# Altium project tinySniff.PrjPcb
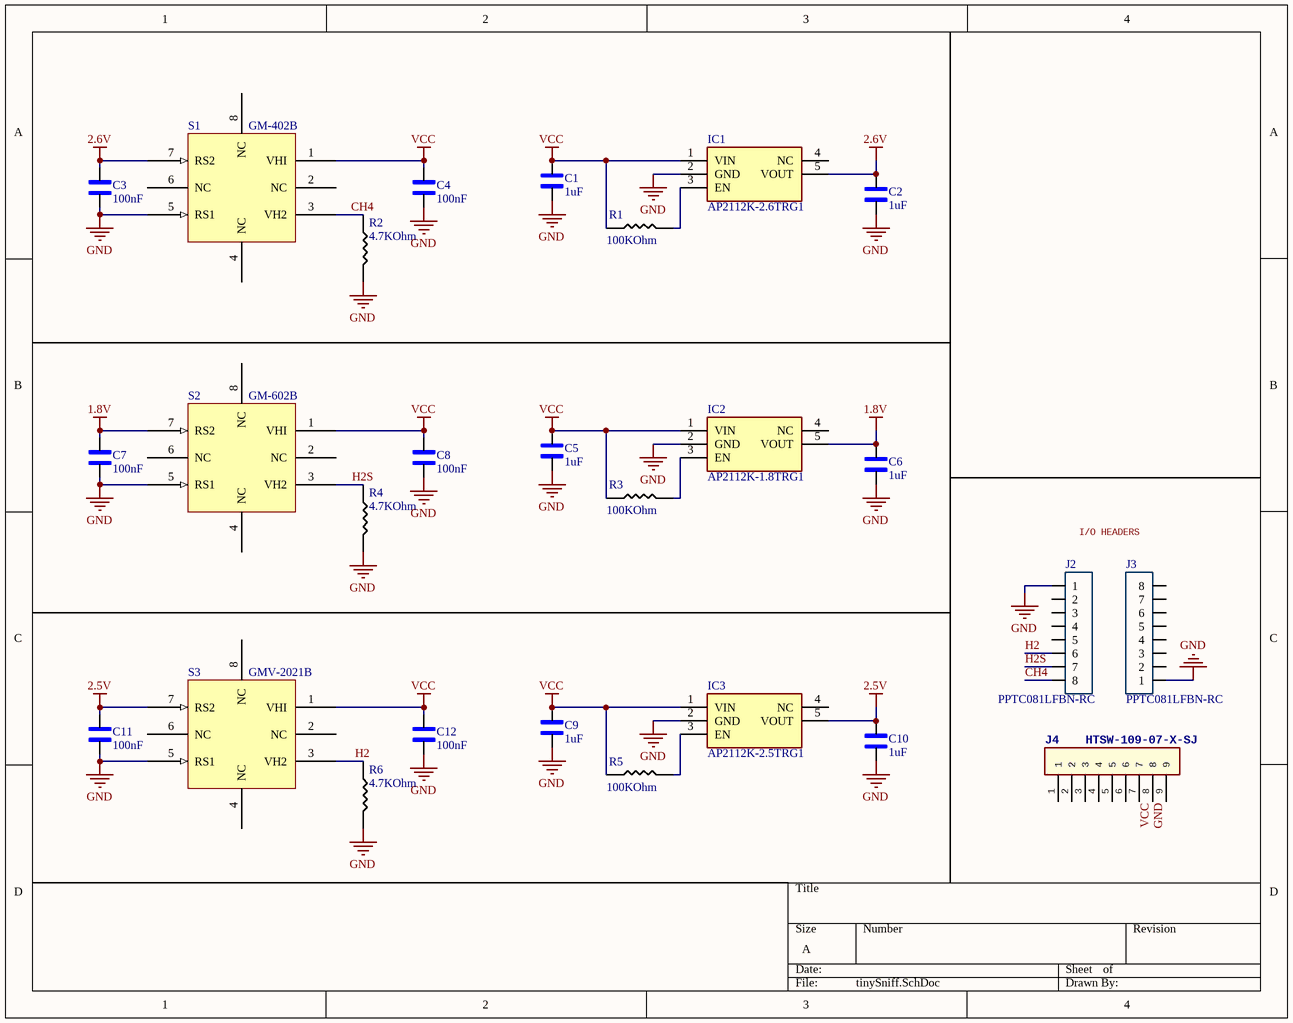
[diagram p0: tinySniff.SchDoc]
1 sheet, 27 parts. Net scope: global (net labels, ports and power ports of the same name join across sheets).
Board file: tinySniff.PcbDoc

## Sheet tinySniff.SchDoc
size A; SheetNumber: 1; SheetTotal: 1

### Parts
C1  1uF  [1206_Passive_Capacitor]
C2  1uF  [1206_Passive_Capacitor]
C3  100nF  [1206_Passive_Capacitor]
C4  100nF  [1206_Passive_Capacitor]
C5  1uF  [1206_Passive_Capacitor]
C6  1uF  [1206_Passive_Capacitor]
C7  100nF  [1206_Passive_Capacitor]
C8  100nF  [1206_Passive_Capacitor]
C9  1uF  [1206_Passive_Capacitor]
C10  1uF  [1206_Passive_Capacitor]
C11  100nF  [1206_Passive_Capacitor]
C12  100nF  [1206_Passive_Capacitor]
IC1  AP2112K-2.6TRG1  [SOT95P285X140-5N]
IC2  AP2112K-1.8TRG1  [SOT95P285X140-5N]
IC3  AP2112K-2.5TRG1  [SOT95P285X140-5N]
J2  PPTC081LFBN-RC  [8_PIN_100MIL - Female]
J3  PPTC081LFBN-RC  [8_PIN_100MIL - Female]
J4  HTSW-109-07-X-SJ  [JM-9_HTSW-109-07-X-S]
R1  100KOhm  [1206_Passive_Resitor]
R2  4.7KOhm  [1206_Passive_Resitor]
R3  100KOhm  [1206_Passive_Resitor]
R4  4.7KOhm  [1206_Passive_Resitor]
R5  100KOhm  [1206_Passive_Resitor]
R6  4.7KOhm  [1206_Passive_Resitor]
S1  GM-402B  [QFN127P500X500X155_HS-9N]
S2  GM-602B  [QFN127P500X500X155_HS-9N]
S3  GMV-2021B  [QFN127P500X500X155_HS-9N]

### Nets
1.8V: C6.2 C7.2 IC2.5(VOUT) S2.7(RS2)
2.5V: C10.2 C11.2 IC3.5(VOUT) S3.7(RS2)
2.6V: C2.2 C3.2 IC1.5(VOUT) S1.7(RS2)
GND: C1.1 C2.1 C3.1 C4.2 C5.1 C6.1 C7.1 C8.2 C9.1 C10.1 C11.1 C12.2 IC1.2(GND) IC2.2(GND) IC3.2(GND) J2.1 J3.1 J4.9 R2.2 R4.2 R6.2 S1.5(RS1) S2.5(RS1) S3.5(RS1)
VCC: C1.2 C4.1 C5.2 C8.1 C9.2 C12.1 IC1.1(VIN) IC2.1(VIN) IC3.1(VIN) J4.8 R1.1 R3.1 R5.1 S1.1(VHI) S2.1(VHI) S3.1(VHI)
CH4: J2.8 R2.1 S1.3(VH2)
H2: J2.6 R6.1 S3.3(VH2)
H2S: J2.7 R4.1 S2.3(VH2)
NetIC1_3: IC1.3(EN) R1.2
NetIC2_3: IC2.3(EN) R3.2
NetIC3_3: IC3.3(EN) R5.2

Not connected (* = marked no-connect by the designer): IC1 4(NC); IC2 4(NC); IC3 4(NC); J2 2 3 4 5; J3 2 3 4 5 6 7 8; J4 1 2 3 4 5 6 7; S1 2(NC) 4(NC) 6(NC) 8(NC); S2 2(NC) 4(NC) 6(NC) 8(NC); S3 2(NC) 4(NC) 6(NC) 8(NC)

### Notes on the sheet
- I/O HEADERS

### Library data of the parts
C1 C2 C5 C6 C9 C10 = C_1uF_1206: MULTILAYER CERAMIC CAPACITORS MLCC - SMD/SMT 1UF 50V 1206 ROHS; MFR Part #: CL31B105KBHNNNE; Type: Basic; Digikey Link: https://www.digikey.com/product-detail/en/C1206C105M4RACTU/399-8150-1-ND/3471873/?itemSeq=304982366; LCSC Part#: C1848; Value: 1uF
C3 C4 C7 C8 C11 C12 = C_47nF_1206: 100nF ±5% 50V C0G 1206 Multilayer Ceramic Capacitors MLCC - SMD/SMT RoHS; MFR Part #: GRM31M5C1H473JA01L; Type: Extended; LCSC Part#: C21812; Datasheet: https://datasheet.lcsc.com/lcsc/1810201313_Murata-Electronics-GRM31M5C1H473JA01L_C21812.pdf; Value: 100nF
IC1-IC3 = CMP-031-00006-1: 600mA 1.8V LDO Regulator Enable SOT23-5; Manufacturer_Name: Diodes Incorporated; Source: SamacSys.SchLib; Arrow Part Number: AP2112K-1.8TRG1; Design Item ID: AP2112K-1.8TRG1; Manufacturer_Part_Number: AP2112K-1.8TRG1; Mouser Price/Stock: https://www.mouser.co.uk/ProductDetail/Diodes-Incorporated/AP2112K-1.8TRG1?qs=x6A8l6qLYDBx1xhw8AX2cw%3D%3D; Height: 1.4mm; Mouser Part Number: 621-AP2112K-1.8TRG1; Datasheet Link: https://www.diodes.com/assets/Datasheets/AP2112.pdf; Arrow Price/Stock: https://www.arrow.com/en/products/ap2112k-1.8trg1/diodes-incorporated?region=nac
J2 J3 = JF_8_PIN_FEMALE: 8 Position Header Connector 0.100" (2.54mm) Through Hole Tin; Digikey Link: https://www.digikey.com/product-detail/en/PPTC081LFBN-RC/S7006-ND/810147/?itemSeq=304982354; MFR Part #: PPTC081LFBN-RC; Type: Extended; LCSC Part#: C27438
J4 = JM_9_PIN_MALE: 2.54mm Black 1x9P Straight,P=2.54mm Pin Headers; MFR PART #: PZ254-1-09-Z-8.5; MFR PN: HTSW-109-07-X-SJ; LCSC PART#: C2894932
R1 R3 R5 = R_100KOhm_1206: 100kΩ ±1% 0.25W ±100ppm/℃ 1206 Chip Resistor - Surface Mount RoHS; MFR Part #: 1206W4F1003T5E; LCSC Part#: C17900; Datasheet: https://datasheet.lcsc.com/lcsc/1810301421_UNI-ROYAL-Uniroyal-Elec-1206W4F1003T5E_C17900.pdf; Type: Basic; Value: 100KOhm
R2 R4 R6 = R_4.7k_1206: 4.7kΩ ±1% 0.25W ±100ppm/℃ 1206 Chip Resistor - Surface Mount RoHS; MFR Part #: 1206W4F4701T5E; LCSC Part#: C17936; Datasheet: https://datasheet.lcsc.com/lcsc/1810301414_UNI-ROYAL-Uniroyal-Elec-1206W4F4701T5E_C17936.pdf; Type: Basic; Value: 4.7KOhm
S1-S3 = CMP-010-00024-1: Generic MEMS footprint for GM series devices from Winsen